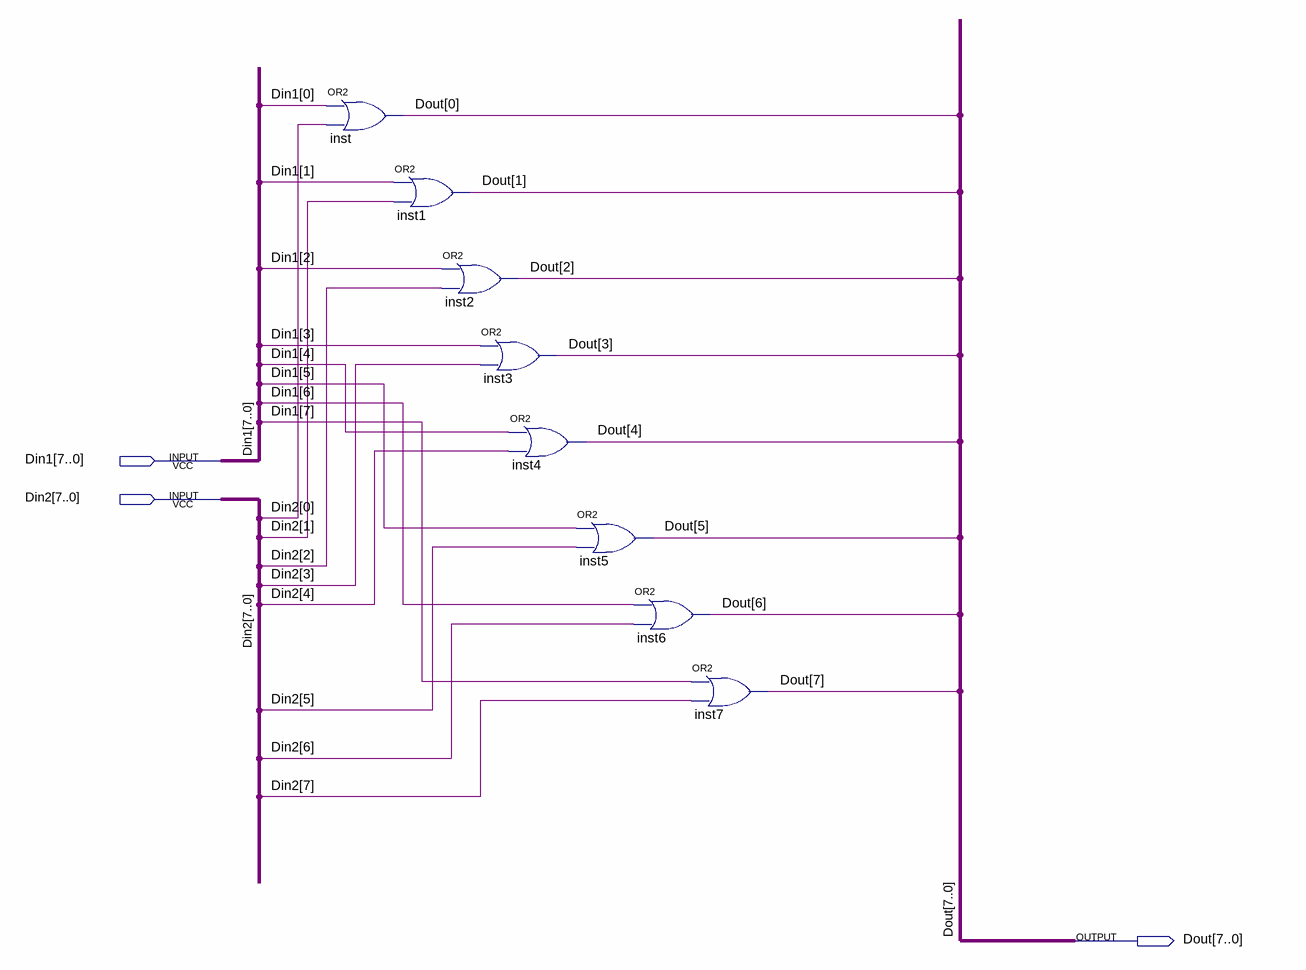
[diagram p0: schematic sheet]
// Quartus schematic or_8bit.bdf as structural Verilog: 8 symbols, 3 pins
module or_8bit (
  input  [7:0] Din1,
  input  [7:0] Din2,
  output [7:0] Dout
);

  or inst (Dout[0], Din1[0], Din2[0]);
  or inst1 (Dout[1], Din1[1], Din2[1]);
  or inst2 (Dout[2], Din1[2], Din2[2]);
  or inst3 (Dout[3], Din1[3], Din2[3]);
  or inst4 (Dout[4], Din1[4], Din2[4]);
  or inst5 (Dout[5], Din1[5], Din2[5]);
  or inst6 (Dout[6], Din1[6], Din2[6]);
  or inst7 (Dout[7], Din1[7], Din2[7]);
endmodule
